# EAGLE schematic radiva3 (EAGLE 7.7.0)

## Sheet 1 of 2
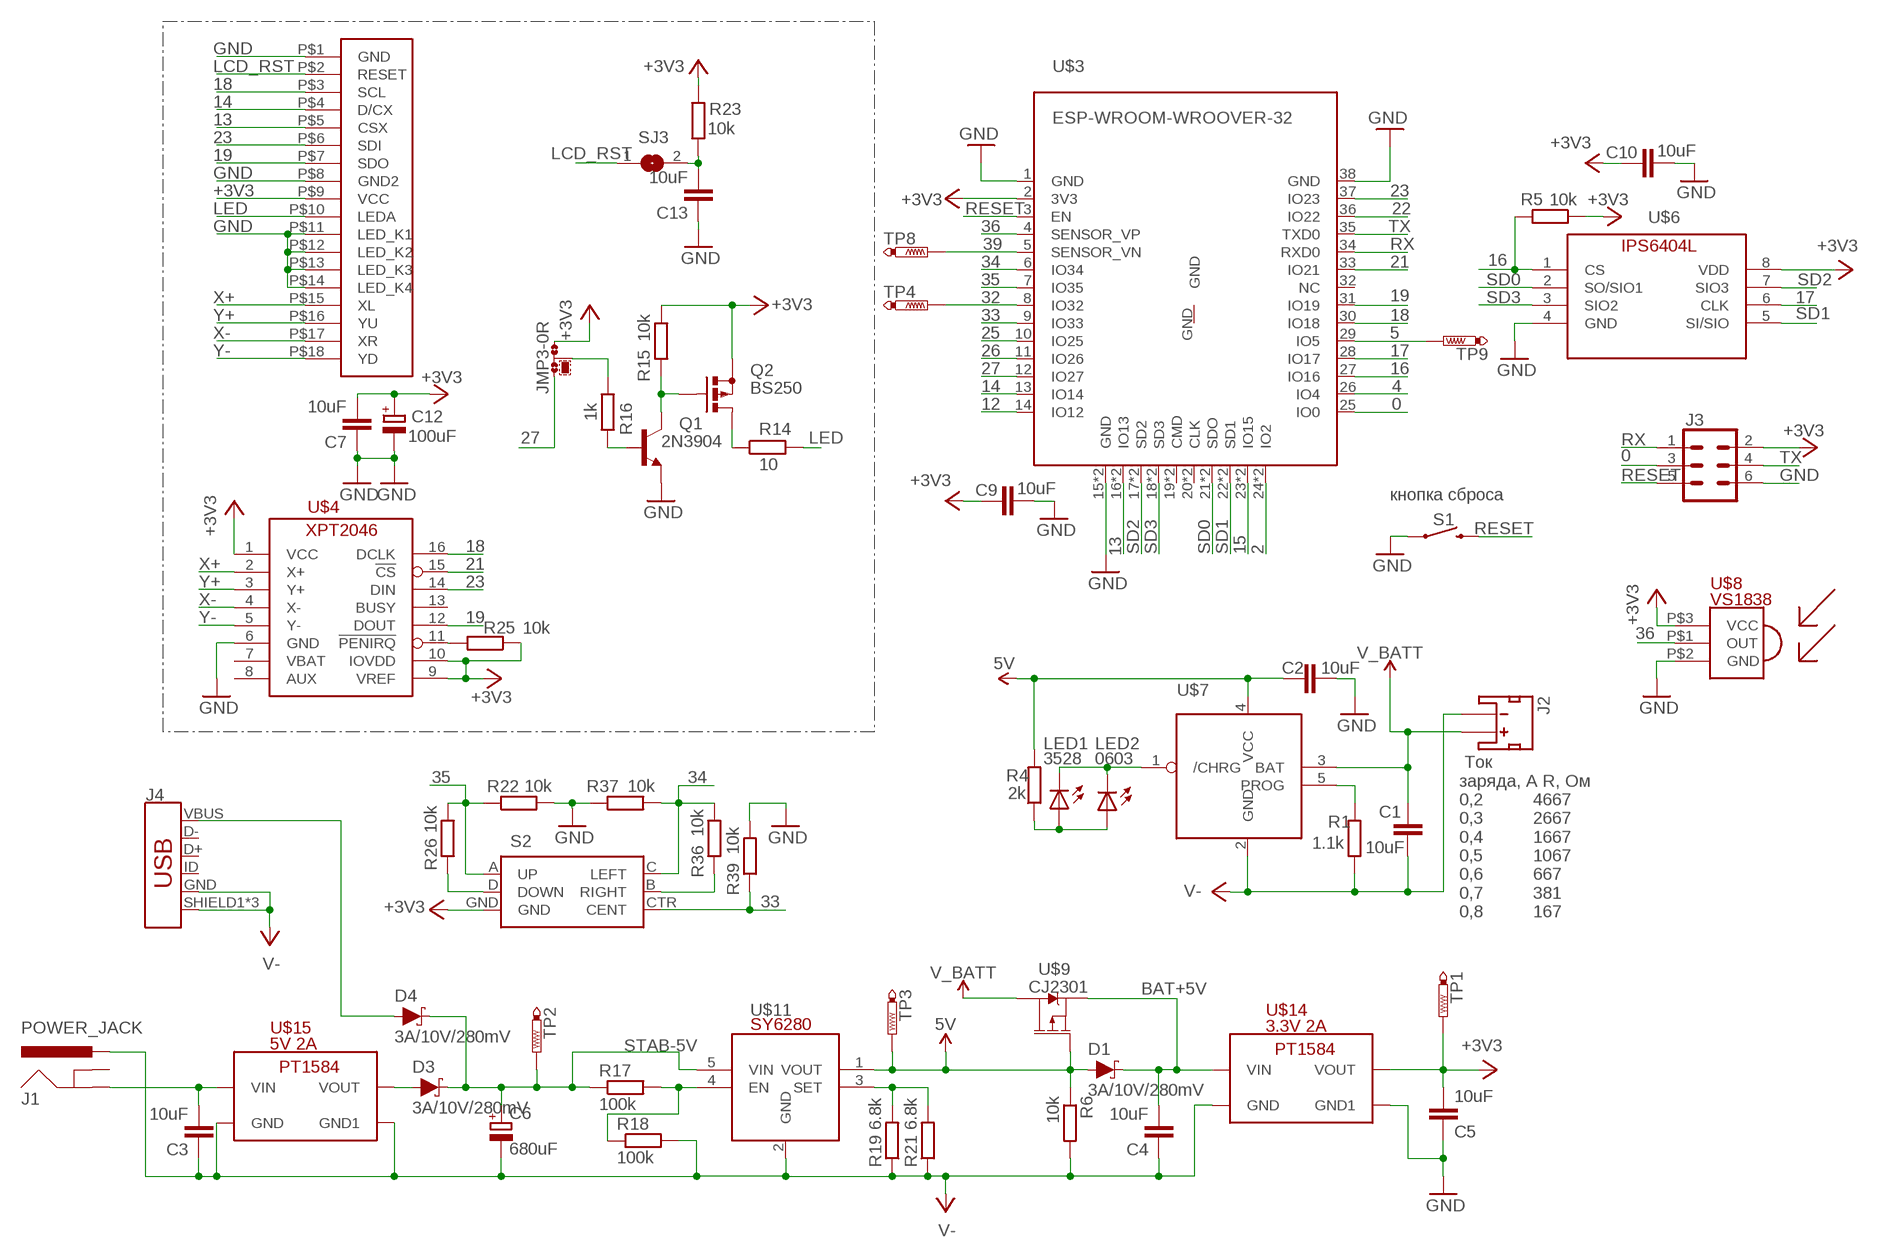
[diagram p0: schematic, sheet 1]

### Parts
C1  10uF  C-EUC0805  [C0805]
C2  10uF  C-EUC0805  [C0805]
C3  10uF  C-EUC0805  [C0805]
C4  10uF  C-EUC0805  [C0805]
C5  10uF  C-EUC0805  [C0805]
C6  680uF  CPOL-EUE5-8.5  [E5-8,5]
C7  10uF  C-EUC0805  [C0805]
C9  10uF  C-EUC0805  [C0805]
C10  10uF  C-EUC0805  [C0805]
C12  100uF  CPOL-EUE5-8.5  [E5-8,5]
C13  10uF  C-EUC0805  [C0805]
D1  3A/10V/280mV  DIODE-SCHOTTKY-BAT60A  [SOD-323]
D3  3A/10V/280mV  DIODE-SCHOTTKY-BAT60A  [SOD-323]
D4  3A/10V/280mV  DIODE-SCHOTTKY-BAT60A  [SOD-323]
J1  POWER_JACK  [POWER_JACK_PTH]
J2  JST_2MM_MALE  [JST-2-SMD]
J3  CONN_03X22X3_SILK_MALE_PTH  [2X3]
J4  USB_MICRO-B_FEMALE-SMT  [USB-B-MICRO-SMD]
JMP3  0R-JUMPC  [C0R-JMP]
LED1  3528  LEDKA-3528ASYC  [KA-3528ASYC]
LED2  0603  LED0603  [LED-0603]
Q1  2N3904  [TO92]
Q2  BS250  [SOT54E]
R1  1.1k  R-EU_R0402  [R0402]
R4  2k  R-EU_R0402  [R0402]
R5  10k  R-EU_R0402  [R0402]
R6  10k  R-EU_R0402  [R0402]
R14  10  R-EU_R0402  [R0402]
R15  10k  R-EU_R0402  [R0402]
R16  1k  R-EU_R0402  [R0402]
R17  100k  R-EU_R0402  [R0402]
R18  100k  R-EU_R0402  [R0402]
R19  6.8k  R-EU_R0402  [R0402]
R21  6.8k  R-EU_R0402  [R0402]
R22  10k  R-EU_R0402  [R0402]
R23  10k  R-EU_R0402  [R0402]
R25  10k  R-EU_R0402  [R0402]
R26  10k  R-EU_R0402  [R0402]
R36  10k  R-EU_R0402  [R0402]
R37  10k  R-EU_R0402  [R0402]
R39  10k  R-EU_R0402  [R0402]
S1  MOMENTARY-SWITCH-SPST-PTH-6.0MM  [TACTILE_SWITCH_PTH_6.0MM]
S2  JOYSTICK_MINI  [JOYSTICK_MINI]
SJ3  SJ  [SJ]
TP1  PTR1PAD1-13  [P1-13]
TP2  PTR1PAD1-13  [P1-13]
TP3  PTR1PAD1-13  [P1-13]
TP4  PTR1B1,27  [B1,27]
TP8  PTR1B1,27  [B1,27]
TP9  PTR1B1,27  [B1,27]
U$3  ESP-WROOM-WROOVER-32  [ESP-WROOM-WROOVER-32]
U$4  XPT2046  [TSSOP16-0.65-5X4.4MM]
U$6  IPS6404L-SQ-SPN  [SO-08]
U$7  TP4054  [SOT23-5]
U$8  VS1838  [IR]
U$9  CJ2301  [SOT23-3]
U$10  TFT-DISPLAY-2.8  [TFT-DISPLAY-2.8]
U$11  SY6280  [SOT23-5]
U$14  3.3V 2A  DC-DC_P1584  [DC-DC_PT1584]
U$15  5V 2A  DC-DC_P1584  [DC-DC_PT1584]

### Nets
0: J3.3 U$3.25(IO0)
2: U$3.24(IO2) U$3.48(IO2) ; also sheet 2
4: U$3.26(IO4) ; also sheet 2
5: TP9.TP U$3.29(IO5)
5V: C2.1 D1.A R4.2 R6.1 TP3.TP U$7.4(VCC) U$9.1(G) U$11.1(VOUT)
12: U$3.14(IO12) ; also sheet 2
13: U$3.16(IO13) U$3.40(IO13) U$10.P$5(CSX)
14: U$3.13(IO14) U$10.P$4(D/CX)
15: U$3.23(IO15) U$3.47(IO15) ; also sheet 2
16: R5.2 U$3.27(IO16) U$6.1(CS)
17: U$3.28(IO17) U$6.6(CLK)
18: U$3.30(IO18) U$4.16(DCLK) U$10.P$3(SCL) ; also sheet 2
19: U$3.31(IO19) U$4.12(DOUT) U$10.P$7(SDO) ; also sheet 2
21: U$3.33(IO21) U$4.15(!CS)
22: U$3.36(IO22) ; also sheet 2
23: U$3.37(IO23) U$4.14(DIN) U$10.P$6(SDI) ; also sheet 2
25: U$3.10(IO25) ; also sheet 2
26: U$3.11(IO26) ; also sheet 2
27: JMP3.1 U$3.12(IO27)
32: TP4.TP U$3.8(IO32)
33: R39.1 S2.CTR(CENT) U$3.9(IO33)
34: R36.2 R37.2 S2.C(LEFT) U$3.6(IO34)
35: R22.1 R26.2 S2.A(UP) U$3.7(IO35)
36: U$3.4(SENSOR_VP) U$8.P$1(OUT)
39: TP8.TP U$3.5(SENSOR_VN)
+3V3: C5.2 C7.2 C9.1 C10.1 C12.+ J3.2 JMP3.3 Q2.S R5.1 R15.1 R23.1 R25.1 S2.GND TP1.TP U$3.2(3V3) U$4.1(VCC) U$4.9(VREF) U$4.10(IOVDD) U$6.8(VDD) U$8.P$3(VCC) U$10.P$9(VCC) U$14.P$4(VOUT) U$14.P$8(VOUT) ; also sheet 2
BAT+5V: C4.2 D1.C U$9.2(S) U$14.P$1(VIN) U$14.P$5(VIN) ; also sheet 2
GND: C2.2 C5.1 C7.1 C9.2 C10.2 C12.- C13.1 J3.6 Q1.3(E) R22.2 R37.1 R39.2 S1.1 U$3.1(GND) U$3.15(GND) U$3.38(GND) U$3.39(GND) U$4.6(GND) U$6.4(GND) U$8.P$2(GND) U$10.P$1(GND) U$10.P$8(GND2) U$10.P$11(LED_K1) U$10.P$12(LED_K2) U$10.P$13(LED_K3) U$10.P$14(LED_K4) U$14.P$3(GND1) U$14.P$7(GND1) ; also sheet 2
LCD_RST: SJ3.1 U$10.P$2(RESET)
LED: R14.2 U$10.P$10(LEDA)
N$1: Q1.1(C) Q2.G R15.2
N$2: Q2.D R14.1
N$4: Q1.2(B) R16.2
N$6: LED1.A LED2.A R4.1
N$7: C3.2 J1.GND U$15.P$1(VIN) U$15.P$5(VIN)
N$8: LED1.C LED2.C U$7.1(/CHRG)
N$9: R1.2 U$7.5(PROG)
N$10: C13.2 R23.2 SJ3.2
N$17: JMP3.2 R16.1
N$19: R17.2 R18.1 U$11.4(EN)
N$20: R19.2 R21.2 U$11.3(SET)
N$32: D3.A U$15.P$4(VOUT) U$15.P$8(VOUT)
N$35: R25.2 U$4.11(!PENIRQ)
N$46: D4.A J4.VBUS
N$47: R36.1 S2.B(RIGHT)
N$50: R26.1 S2.D(DOWN)
RESET: J3.5 S1.3 U$3.3(EN)
RX: J3.1 U$3.34(RXD0)
SD0: U$3.21(SDO) U$3.45(SDO) U$6.2(SO/SIO1)
SD1: U$3.22(SD1) U$3.46(SD1) U$6.5(SI/SIO)
SD2: U$3.17(SD2) U$3.41(SD2) U$6.7(SIO3)
SD3: U$3.18(SD3) U$3.42(SD3) U$6.3(SIO2)
STAB-5V: C6.+ D3.C D4.C R17.1 TP2.TP U$11.5(VIN)
TX: J3.4 U$3.35(TXD0)
V-: C1.1 C3.1 C4.1 C6.- J1.PWR J2.1(-) J4.GND J4.SHIELD1(SHIELD) J4.SHIELD2(SHIELD) J4.SHIELD3(SHIELD) R1.1 R6.2 R18.2 R19.1 R21.1 U$7.2(GND) U$11.2(GND) U$14.P$2(GND) U$14.P$6(GND) U$15.P$2(GND) U$15.P$3(GND1) U$15.P$6(GND) U$15.P$7(GND1)
V_BATT: C1.2 J2.2(+) U$7.3(BAT) U$9.3(D)
X+: U$4.2(X+) U$10.P$15(XL)
X-: U$4.4(X-) U$10.P$17(XR)
Y+: U$4.3(Y+) U$10.P$16(YU)
Y-: U$4.5(Y-) U$10.P$18(YD)
Unconnected: J1.GNDBREAK J2.NC1(PAD1) J2.NC2(PAD2) J4.D+ J4.D- J4.ID U$3.19(CMD) U$3.20(CLK) U$3.32(NC) U$3.43(CMD) U$3.44(CLK) U$3.GND U$4.7(VBAT) U$4.8(AUX) U$4.13(BUSY)

### Notes on the sheet
- кнопка сброса
- Ток
  заряда, А R, Oм
  0,2          4667
  0,3          2667
  0,4          1667
  0,5          1067
  0,6          667
  0,7          381
  0,8          167

## Sheet 2 of 2: vs1053
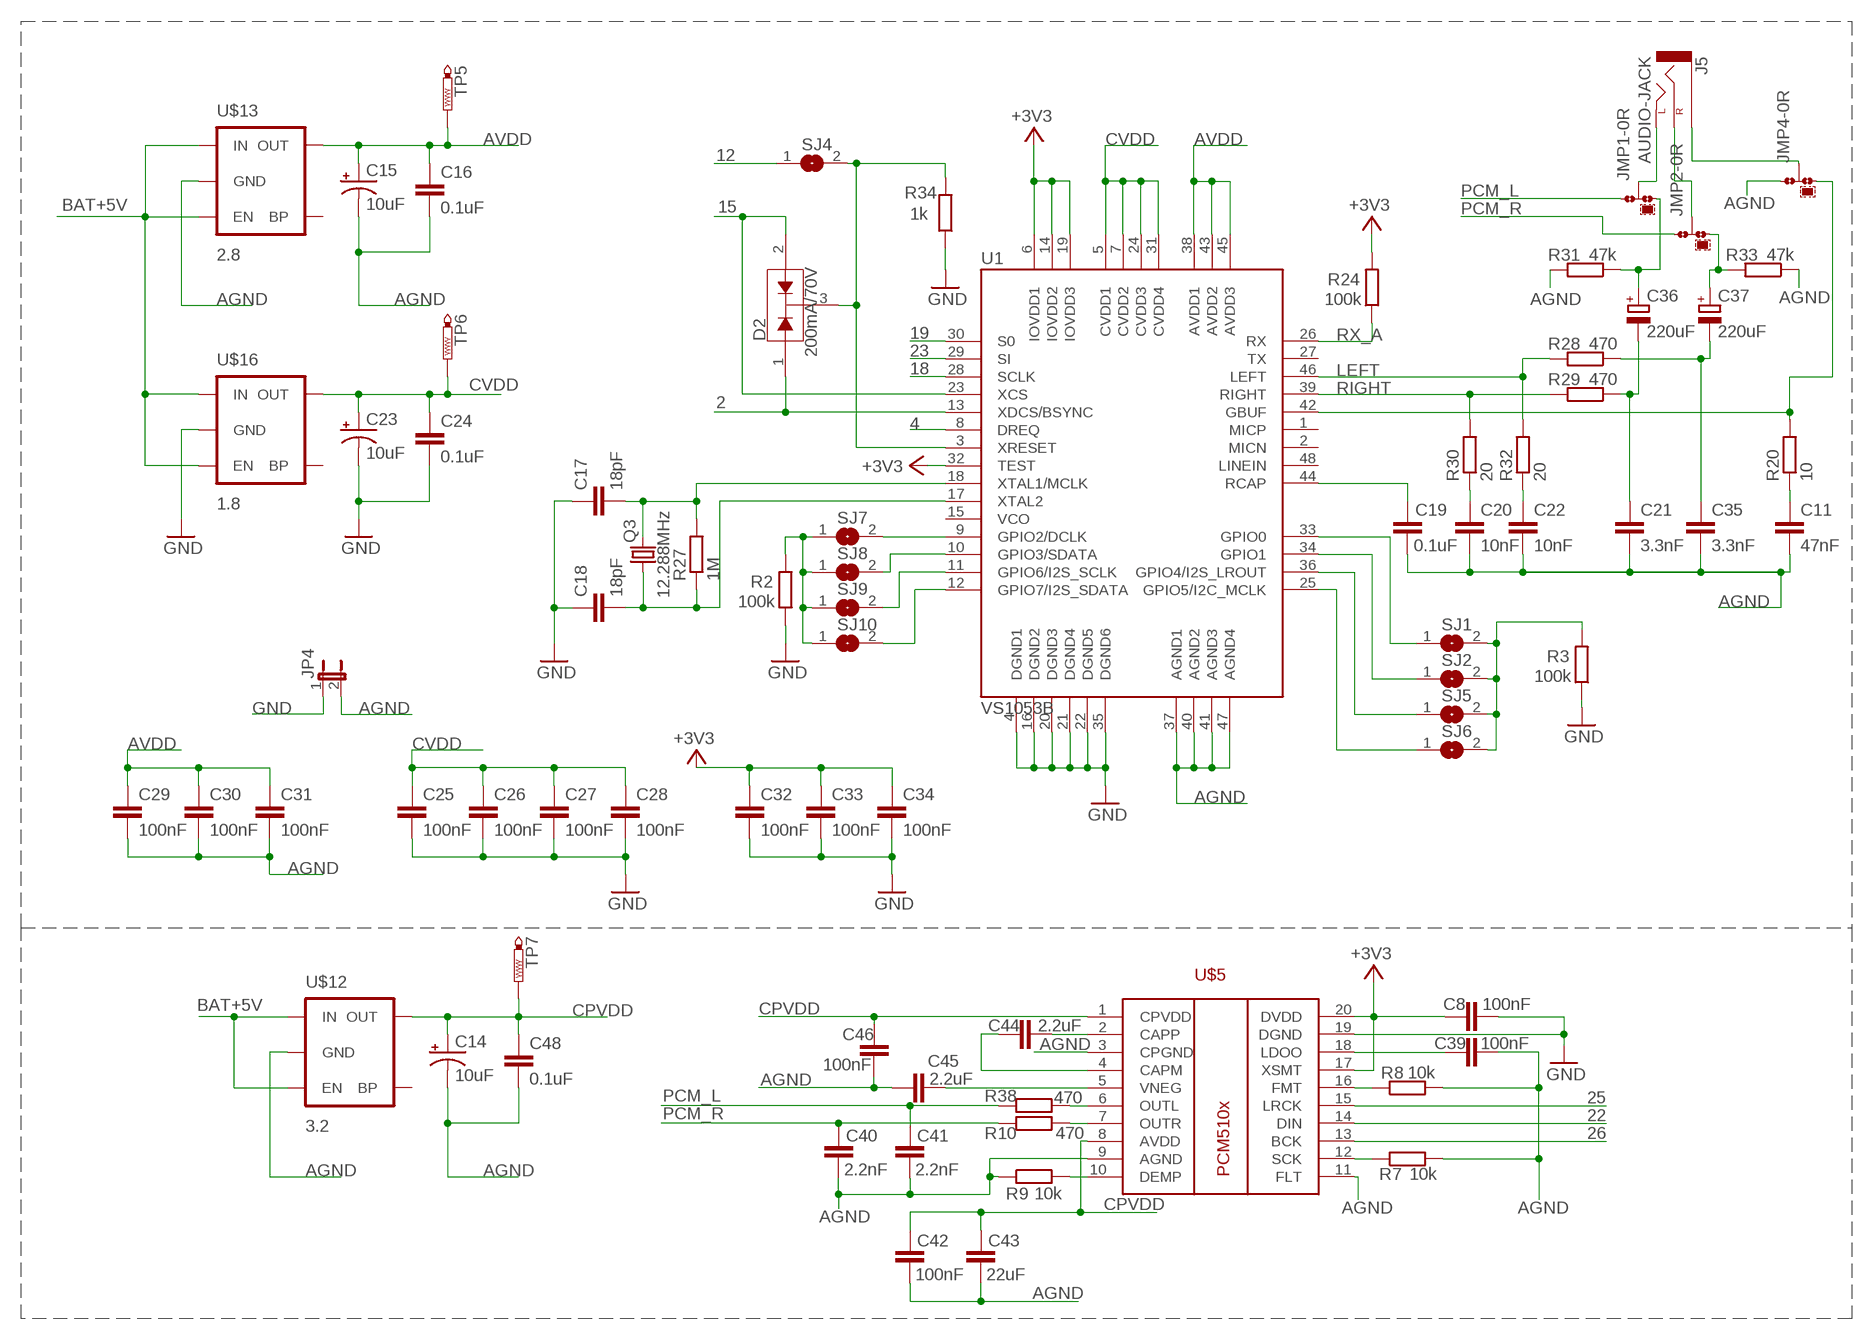
[diagram p1: schematic, sheet 2]

### Parts
C8  100nF  CAP0402-CAP  [0402-CAP]
C11  47nF  CAP0402-CAP  [0402-CAP]
C14  10uF  CAP_POL1206  [EIA3216]
C15  10uF  CAP_POL1206  [EIA3216]
C16  0.1uF  CAP0402-CAP  [0402-CAP]
C17  18pF  CAP0402-CAP  [0402-CAP]
C18  18pF  CAP0402-CAP  [0402-CAP]
C19  0.1uF  CAP0402-CAP  [0402-CAP]
C20  10nF  CAP0402-CAP  [0402-CAP]
C21  3.3nF  CAP0402-CAP  [0402-CAP]
C22  10nF  CAP0402-CAP  [0402-CAP]
C23  10uF  CAP_POL1206  [EIA3216]
C24  0.1uF  CAP0402-CAP  [0402-CAP]
C25  100nF  CAP0402-CAP  [0402-CAP]
C26  100nF  CAP0402-CAP  [0402-CAP]
C27  100nF  CAP0402-CAP  [0402-CAP]
C28  100nF  CAP0402-CAP  [0402-CAP]
C29  100nF  CAP0402-CAP  [0402-CAP]
C30  100nF  CAP0402-CAP  [0402-CAP]
C31  100nF  CAP0402-CAP  [0402-CAP]
C32  100nF  CAP0402-CAP  [0402-CAP]
C33  100nF  CAP0402-CAP  [0402-CAP]
C34  100nF  CAP0402-CAP  [0402-CAP]
C35  3.3nF  CAP0402-CAP  [0402-CAP]
C36  220uF  CPOL-EUE2.5-6  [E2,5-6]
C37  220uF  CPOL-EUE2.5-6  [E2,5-6]
C39  100nF  CAP0402-CAP  [0402-CAP]
C40  2.2nF  CAP0402-CAP  [0402-CAP]
C41  2.2nF  CAP0402-CAP  [0402-CAP]
C42  100nF  CAP0402-CAP  [0402-CAP]
C43  22uF  CAP0805  [0805]
C44  2.2uF  CAP0603-CAP  [0603-CAP]
C45  2.2uF  CAP0603-CAP  [0603-CAP]
C46  100nF  CAP0402-CAP  [0402-CAP]
C48  0.1uF  CAP0402-CAP  [0402-CAP]
D2  200mA/70V  BAV70  [SOT23-3]
J5  AUDIO-JACK  [AUDIO-JACK]
JMP1  0R-JUMPC  [C0R-JMP]
JMP2  0R-JUMPC  [C0R-JMP]
JMP4  0R-JUMPC  [C0R-JMP]
JP4  JUMPER-2SMD-NC  [SJ_2S]
Q3  12.288MHz  CRYSTALPTH-HC49UV  [HC49U]
R2  100k  R-EU_R0402  [R0402]
R3  100k  R-EU_R0402  [R0402]
R7  10k  R-EU_R0402  [R0402]
R8  10k  R-EU_R0402  [R0402]
R9  10k  R-EU_R0402  [R0402]
R10  470  R-EU_R0402  [R0402]
R20  10  R-EU_R0402  [R0402]
R24  100k  R-EU_R0402  [R0402]
R27  1M  R-EU_R0402  [R0402]
R28  470  R-EU_R0402  [R0402]
R29  470  R-EU_R0402  [R0402]
R30  20  R-EU_R0402  [R0402]
R31  47k  R-EU_R0402  [R0402]
R32  20  R-EU_R0402  [R0402]
R33  47k  R-EU_R0402  [R0402]
R34  1k  R-EU_R0402  [R0402]
R38  470  R-EU_R0402  [R0402]
SJ1  SJ  [SJ]
SJ2  SJ  [SJ]
SJ4  SJ  [SJ]
SJ5  SJ  [SJ]
SJ6  SJ  [SJ]
SJ7  SJ  [SJ]
SJ8  SJ  [SJ]
SJ9  SJ  [SJ]
SJ10  SJ  [SJ]
TP5  PTR1B1,27  [B1,27]
TP6  PTR1B1,27  [B1,27]
TP7  PTR1B1,27  [B1,27]
U1  VS1053B  VS1053SMD  [LQFP-48]
U$5  PCM510X  [SSOP20]
U$12  3.2  V_REG_LDOSMD2  [SC70]
U$13  2.8  V_REG_LDOSMD2  [SC70]
U$16  1.8  V_REG_LDOSMD2  [SC70]

### Nets
2: D2.1(A1) U1.13(XDCS/BSYNC) ; also sheet 1
4: U1.8(DREQ) ; also sheet 1
12: SJ4.1 ; also sheet 1
15: D2.2(A2) U1.23(XCS) ; also sheet 1
18: U1.28(SCLK) ; also sheet 1
19: U1.30(S0) ; also sheet 1
22: U$5.14(DIN) ; also sheet 1
23: U1.29(SI) ; also sheet 1
25: U$5.15(LRCK) ; also sheet 1
26: U$5.13(BCK) ; also sheet 1
+3V3: C8.1 C32.1 C33.1 C34.1 R24.2 U1.6(IOVDD1) U1.14(IOVDD2) U1.19(IOVDD3) U1.32(TEST) U$5.17(XSMT) U$5.20(DVDD) ; also sheet 1
AGND: C11.2 C14.C(-) C15.C(-) C16.2 C19.1 C20.2 C21.2 C22.2 C29.2 C30.2 C31.2 C35.2 C39.2 C40.2 C41.2 C42.2 C43.2 C45.1 C46.1 C48.2 JMP4.1 JP4.2 R7.2 R8.2 R9.1 R31.2 R33.1 U1.37(AGND1) U1.40(AGND2) U1.41(AGND3) U1.47(AGND4) U$5.3(CPGND) U$5.9(AGND) U$5.11(FLT) U$12.2(GND) U$13.2(GND)
AVDD: C15.A(+) C16.1 C29.1 C30.1 C31.1 TP5.TP U1.38(AVDD1) U1.43(AVDD2) U1.45(AVDD3) U$13.5(OUT)
BAT+5V: U$12.1(IN) U$12.3(EN) U$13.1(IN) U$13.3(EN) U$16.1(IN) U$16.3(EN) ; also sheet 1
CPVDD: C14.A(+) C42.1 C43.1 C46.2 C48.1 TP7.TP U$5.1(CPVDD) U$5.8(AVDD) U$12.5(OUT)
CVDD: C23.A(+) C24.1 C25.1 C26.1 C27.1 C28.1 TP6.TP U1.5(CVDD1) U1.7(CVDD2) U1.24(CVDD3) U1.31(CVDD4) U$16.5(OUT)
GBUF: JMP4.3 R20.2 U1.42(GBUF)
GND: C8.2 C17.1 C18.1 C23.C(-) C24.2 C25.2 C26.2 C27.2 C28.2 C32.2 C33.2 C34.2 JP4.1 R2.1 R3.1 R34.1 U1.4(DGND1) U1.16(DGND2) U1.20(DGND3) U1.21(DGND4) U1.22(DGND5) U1.35(DGND6) U$5.19(DGND) U$16.2(GND) ; also sheet 1
LEFT: R28.2 R32.2 U1.46(LEFT)
N$3: R8.1 U$5.16(FMT)
N$5: SJ7.2 U1.9(GPIO2/DCLK)
N$11: SJ1.1 U1.33(GPIO0)
N$12: SJ2.1 U1.34(GPIO1)
N$13: C39.1 U$5.18(LDOO)
N$14: R7.1 U$5.12(SCK)
N$15: SJ5.1 U1.36(GPIO4/I2S_LROUT)
N$16: R3.2 SJ1.2 SJ2.2 SJ5.2 SJ6.2
N$18: C21.1 C36.- R29.1
N$21: C35.1 C37.- R28.1
N$22: C17.2 Q3.2 R27.2 U1.18(XTAL1/MCLK)
N$23: J5.P$1(LEFT) J5.P$5(LEFT) JMP1.2
N$24: C18.2 Q3.1 R27.1 U1.17(XTAL2)
N$25: C19.2 U1.44(RCAP)
N$26: C22.1 R32.1
N$27: J5.P$2(RIGHT) JMP2.2
N$28: C20.1 R30.1
N$29: C11.1 R20.1
N$30: C37.+ JMP2.3 R33.2
N$31: C36.+ JMP1.3 R31.1
N$33: SJ6.1 U1.25(GPIO5/I2C_MCLK)
N$34: SJ10.2 U1.12(GPIO7/I2S_SDATA)
N$36: SJ9.2 U1.11(GPIO6/I2S_SCLK)
N$37: SJ8.2 U1.10(GPIO3/SDATA)
N$38: R9.2 U$5.10(DEMP)
N$39: R10.2 U$5.7(OUTR)
N$40: R38.2 U$5.6(OUTL)
N$41: C45.2 U$5.5(VNEG)
N$42: C44.2 U$5.2(CAPP)
N$43: C44.1 U$5.4(CAPM)
N$44: J5.P$3(SLEEVE) J5.P$4(SLEEVE) JMP4.2
N$45: R2.2 SJ7.1 SJ8.1 SJ9.1 SJ10.1
PCM_L: C41.1 JMP1.1 R38.1
PCM_R: C40.1 JMP2.1 R10.1
RIGHT: R29.2 R30.2 U1.39(RIGHT)
RX_A: R24.1 U1.26(RX)
XRESET: D2.3(COM) R34.2 SJ4.2 U1.3(XRESET)
Unconnected: U1.1(MICP) U1.2(MICN) U1.15(VCO) U1.27(TX) U1.48(LINEIN) U$12.4(BP) U$13.4(BP) U$16.4(BP)

## Library data of the parts
C1-C5 C7 C9 C10 C13 = resistor:C-EU: CAPACITOR, European symbol
C6 C12 = rcl:CPOL-EU: POLARIZED CAPACITOR, European symbol
C8 C11 C16-C22 C24-C35 C39-C46 C48 = SparkFun:CAP: Capacitor Standard 0603 ceramic capacitor, and 0.1" leaded capacitor.
C14 C15 C23 = SparkFun:CAP_POL: Capacitor Polarized These are standard SMD and PTH capacitors. Normally 10uF, 47uF, and 100uF in electrolytic and tantalum varieties. Always verify the external diameter of the through hole cap, it varies with capacity, voltage, and manufacturer. The EIA devices should be standard.
C36 C37 = resistor:CPOL-EU: POLARIZED CAPACITOR, European symbol
D1 D3 D4 = SparkFun-DiscreteSemi:DIODE-SCHOTTKY: Schottky diode A Schottky diode is a semiconductor diode which has a low forward voltage drop and a very fast switching action.; PROD_ID: DIO-14072
D2 = radiva:BAV70: Series-pair diode array Two small signal silicon diodes connected anode to cathode. Connections to all three nodes available. Link to datasheet <https://www.fairchildsemi.com/datasheets/BA/BAV99.pdf> SparkFun Products: SparkFun AutoDriver <https://www.sparkfun.com/products/13752>; PROD_ID: DIO-10647
J1 = SparkFun-Connectors:POWER_JACK: Power Jack Connector This is the standard 5.5mm barrel jack for power. The PTH is the most common, proven, reliable, footprint. The Slot footprint only works if the mill layer is transmitted to the PCB fab house so be warned. Here are the connectors we sell at SparkFun: DC Barrel Power Jack/Connector <https://www.sparkfun.com/products/119> (PRT-00119) DC Barrel Power Jack/Connector (SMD) <https://www.sparkfun.com/products/12748> (PRT-12748) DC Barrel Jack Adapter - Breadboard Compatible <https://www.sparkfun.com/products/10811> (PRT-10811) It is used on this SparkFun product (and many, many others): SparkFun RedBoard - Programmed with Arduino <https://www.sparkfun.com/products/12757> (DEV-12757) Also, if you need a mating power supply or connector, please check these out: Wall Adapter Power Supply - 9VDC 650mA <https://www.sparkfun.com/products/298> (TOL-00298) DC Barrel Jack Adapter - Male <https://www.sparkfun.com/products/10287> (PRT-10287); PROD_ID: CONN-08197
J2 = SparkFun-Connectors:JST_2MM_MALE: JST 2MM MALE RA CONNECTOR Two pin, compact surface mount connector. Commonly used as a battery input connection point. We really like the solid locking feeling and high current rating on these small connectors. We use these all the time as battery connectors. Mates to single-cell LiPo batteries. Here is the connector we sell at SparkFun: JST Right Angle Connector - White <https://www.sparkfun.com/products/8612> (PRT-08612) Datasheet <http://www.sparkfun.com/datasheets/Prototyping/Connectors/JST-Horizontal.pdf> It was used on these SparkFun products: SparkFun MOSFET Power Controller <https://www.sparkfun.com/products/11214> (PRT-11214) SparkFun Battery Babysitter - LiPo Battery Manager <https://www.sparkfun.com/products/13777> (PRT-13777) And many, many others that required a lipo battery connection.; PROD_ID: CONN-11443; SF_ID: PRT-08612
J3 = SparkFun-Connectors:CONN_03X2: Multi connection point. Often used as Generic Header-pin footprint for 0.1 inch spaced/style header connections You can populate with any combo of single row headers, but if you'd like an exact match, check these: Header - 2x3 (Male, 0.1") <https://www.sparkfun.com/products/12807> (PRT-12807) Header - 2x3 (Female, 0.1") <https://www.sparkfun.com/products/13010> (PRT-13010) 2x3 Pin Shrouded Header <https://www.sparkfun.com/products/10877> (PRT-10877) On any of the 0.1 inch spaced packages, you can populate with these: Break Away Headers - Straight <https://www.sparkfun.com/products/116> (PRT-00116) Break Away Male Headers - Right Angle <https://www.sparkfun.com/products/553> (PRT-00553) Female Headers <https://www.sparkfun.com/products/115> (PRT-00115) Break Away Headers - Machine Pin <https://www.sparkfun.com/products/117> (PRT-00117) Break Away Female Headers - Swiss Machine Pin <https://www.sparkfun.com/products/743> (PRT-00743) Special note: the shrouded connector mates well with our 3x2 ribbon cables: Ribbon Crimp Connector - 6-pin (2x3, Female) <https://www.sparkfun.com/products/10651> (PRT-10651) Ribbon Cable - 6 wire (15ft) <https://www.sparkfun.com/products/10646> (PRT-10646); PROD_ID: CONN-09701
J4 = SparkFun-Connectors:USB_MICRO-B: USB Type Micro-B Connector Male/female and PTH/SMT variants SparkFun Products: SparkFun microB USB Breakout <https://www.sparkfun.com/products/12035> SparkFun USB microB Plug Breakout <https://www.sparkfun.com/products/10031> SparkFun ESP8266 Thing <https://www.sparkfun.com/products/13231>; PROD_ID: CONN-11752
J5 = radiva:AUDIO-JACK
JMP1-JMP4 = jump-0r-smd:0R-JUMP: SMD 0R 0805 Jumper
JP4 = SparkFun:JUMPER-2: Jumper Basic 0.1" spaced jumper. Use with breakaway headers.
LED1 = led:LED: LED OSRAM: - CHIPLED LG R971, LG N971, LY N971, LG Q971, LY Q971, LO R971, LY R971 LH N974, LH R974 LS Q976, LO Q976, LY Q976 LO Q996 - Hyper CHIPLED LW Q18S LB Q993, LB Q99A, LB R99A - SideLED LS A670, LO A670, LY A670, LG A670, LP A670 LB A673, LV A673, LT A673, LW A673 LH A674 LY A675 LS A676, LA A676, LO A676, LY A676, LW A676 LS A679, LY A679, LG A679 - Hyper Micro SIDELED® LS Y876, LA Y876, LO Y876, LY Y876 LT Y87S - SmartLED LW L88C, LW L88S LB L89C, LB L89S, LG L890 LS L89K, LO L89K, LY L89K LS L896, LA L896, LO L896, LY L896 - TOPLED LS T670, LO T670, LY T670, LG T670, LP T670 LSG T670, LSP T670, LSY T670, LOP T670, LYG T670 LG T671, LOG T671, LSG T671 LB T673, LV T673, LT T673, LW T673 LH T674 LS T676, LA T676, LO T676, LY T676, LB T676, LH T676, LSB T676, LW T676 LB T67C, LV T67C, LT T67C, LS T67K, LO T67K, LY T67K, LW E67C LS E67B, LA E67B, LO E67B, LY E67B, LB E67C, LV E67C, LT E67C LW T67C LS T679, LY T679, LG T679 LS T770, LO T770, LY T770, LG T770, LP T770 LB T773, LV T773, LT T773, LW T773 LH T774 LS E675, LA E675, LY E675, LS T675 LS T776, LA T776, LO T776, LY T776, LB T776 LHGB T686 LT T68C, LB T68C - Hyper Mini TOPLED® LB M676 - Mini TOPLED Santana® LG M470 LS M47K, LO M47K, LY M47K Source: http://www.osram.convergy.de LUXEON: - LUMILED® LXK2-PW12-R00, LXK2-PW12-S00, LXK2-PW14-U00, LXK2-PW14-V00 LXK2-PM12-R00, LXK2-PM12-S00, LXK2-PM14-U00 LXK2-PE12-Q00, LXK2-PE12-R00, LXK2-PE12-S00, LXK2-PE14-T00, LXK2-PE14-U00 LXK2-PB12-K00, LXK2-PB12-L00, LXK2-PB12-M00, LXK2-PB14-N00, LXK2-PB14-P00, LXK2-PB14-Q00 LXK2-PR12-L00, LXK2-PR12-M00, LXK2-PR14-Q00, LXK2-PR14-R00 LXK2-PD12-Q00, LXK2-PD12-R00, LXK2-PD12-S00 LXK2-PH12-R00, LXK2-PH12-S00 LXK2-PL12-P00, LXK2-PL12-Q00, LXK2-PL12-R00 Source: www.luxeon.com KINGBRIGHT: KA-3528ASYC Source: www.kingbright.com
LED2 = SparkFun:LED: LEDs Standard schematic elements and footprints for 5mm, 3mm, 1206, and 0603 sized LEDs. 5mm - Spark Fun Electronics SKU : COM-00529 (and others)
Q1 = transistor-npn:2N3904: NPN Transistor
Q2 = transistor-small-signal:BS250: P-CHANNEL MOS FET
Q3 = SparkFun-Clocks:CRYSTAL: Crystals (Generic) These are passive quartz crystals, which can be used as a clock source for a microcontroller. Crystal's are two-terminal devices. They require external "load" capacitors to generate an oscillating signal.
R1-R10 R14-R34 R36-R39 = resistor:R-EU_: RESISTOR, European symbol
S1 = SparkFun-Switches:MOMENTARY-SWITCH-SPST: Momentary Switch (Pushbutton) - SPST Normally-open (NO) SPST momentary switches (buttons, pushbuttons). Variants PTH-12MM - 12mm square, through-hole Momentary Pushbutton Switch - 12mm Square <https://www.sparkfun.com/products/9190> (COM-09190) PTH-6.0MM, PTH-6.0MM-KIT - 6.0mm square, through-hole Mini Pushbutton Switch <https://www.sparkfun.com/products/97> (COM-00097) KIT package intended for soldering kit's - only one side of pads' copper is exposed. PTH-RIGHT-ANGLE-KIT - Right-angle, through-hole Right Angle Tactile Button <https://www.sparkfun.com/products/10791> - Used on SparkFun BigTime Watch Kit <https://www.sparkfun.com/products/11734> SMD-12MM - 12mm square, surface-mount Tactile Button - SMD (12mm) <https://www.sparkfun.com/products/12993> (COM-12993) Used on SparkFun PicoBoard <https://www.sparkfun.com/products/11888> SMD-4.5MM - 4.5mm Square Trackball Switch Used on SparkFun Blackberry Trackballer Breakout <https://www.sparkfun.com/products/13169> SMD-4.6MMX2.8MM - 4.60mm x 2.80mm, surface mount Used on SparkFun SAMD21 Mini Breakout <https://www.sparkfun.com/products/13664> SMD-5.2MM, SMD-5.2-REDUNDANT - 5.2mm square, surface-mount Mini Pushbutton Switch - SMD <https://www.sparkfun.com/products/8720> (COM-08720) Used on Arduino Pro Mini <https://www.sparkfun.com/products/11114> REDUNDANT package connects both switch circuits together SMD-6.0X3.5MM - 6.0 x 3.5mm, surface mount Momentary Reset Switch SMD <https://www.sparkfun.com/products/8229> (COM-08229) SMD-6.2MM-TALL - 6.2mm square, surface mount Tactile Button - SMD (6mm) <https://www.sparkfun.com/products/12992> Used on SparkFun Digital Sandbox <https://www.sparkfun.com/products/12651> SMD-RIGHT-ANGLE - Right-angle, surface mount Used on SparkFun Block for Intel® Edison - Arduino <https://www.sparkfun.com/products/13036>; PROD_ID: SWCH-08441; SF_SKU: COM-00097
S2 = SparkFun-Switches:JOYSTICK_MINI: Small Tactile Joystick w/ Select Switch A 5-way tactile switch allows for a joystick-like interface in a very small package. Part #: 4UCON SF303GJ26 SparkFun Products 5-way Tactile Switch <https://www.sparkfun.com/products/10063> (COM-10063) Used on SparkFun Block for Intel® Edison - OLED <https://www.sparkfun.com/products/13035> (DEV-13035) Used on CAN-BUS Shield <https://www.sparkfun.com/products/13262> (DEV-13262); PROD_ID: SWCH-09905; SF_SKU: COM-10063
SJ1-SJ10 = jumper:SJ: SMD solder JUMPER
TP1-TP9 = testpad:PTR1: TEST PIN
U1 = radiva:VS1053: VS1053B MP3 and MIDI Codec AAC/MP3/WMA/MIDI/Ogg Audio Player and Ogg Recording Device LQFP-48 7x7x1.4 mm Datasheet <http://www.sparkfun.com/datasheets/Components/SMD/vs1053.pdf> SparkFun Products Storefront component: MP3 and MIDI Codec - VS1053B <https://www.sparkfun.com/products/8892> (COM-08892) SparkFun MP3 Player Shield <https://www.sparkfun.com/products/12660> (DEV-12660) LilyPad MP3 <https://www.sparkfun.com/products/11013> (DEV-11013) SparkFun Music Instrument Shield <https://www.sparkfun.com/products/10587> (DEV-10587); PROD_ID: IC-12665
U$3 = radiva:ESP-WROOM-WROOVER-32
U$4 = radiva:XPT2046
U$5 = radiva:PCM510X
U$6 = radiva:IPS6404L-SQ-SPN
U$7 = radiva:TP4054
U$8 = radiva:VS1838
U$9 = radiva:CJ2301
U$10 = 32teeth - TFT Displays:TFT-DISPLAY-2.8
U$11 = radiva:SY6280
U$12 U$13 U$16 = SparkFun:V_REG_LDO: Voltage Regulator LDO Standard 150mA LDO voltage regulator in SOT-23 layout. Micrel part MIC5205. BP (by-pass) pin is used to lower output noise with 470pF cap.
U$14 U$15 = radiva:DC-DC_P1584